# EasyEDA schematic 1-Schematic_main_project_bg-butwal.json
TITLE: Sheet_1; REV: 1.0; Date: 2026-04-19; Sheet: 1/1; Drawn By: niranjanstha11; Company: Your Company
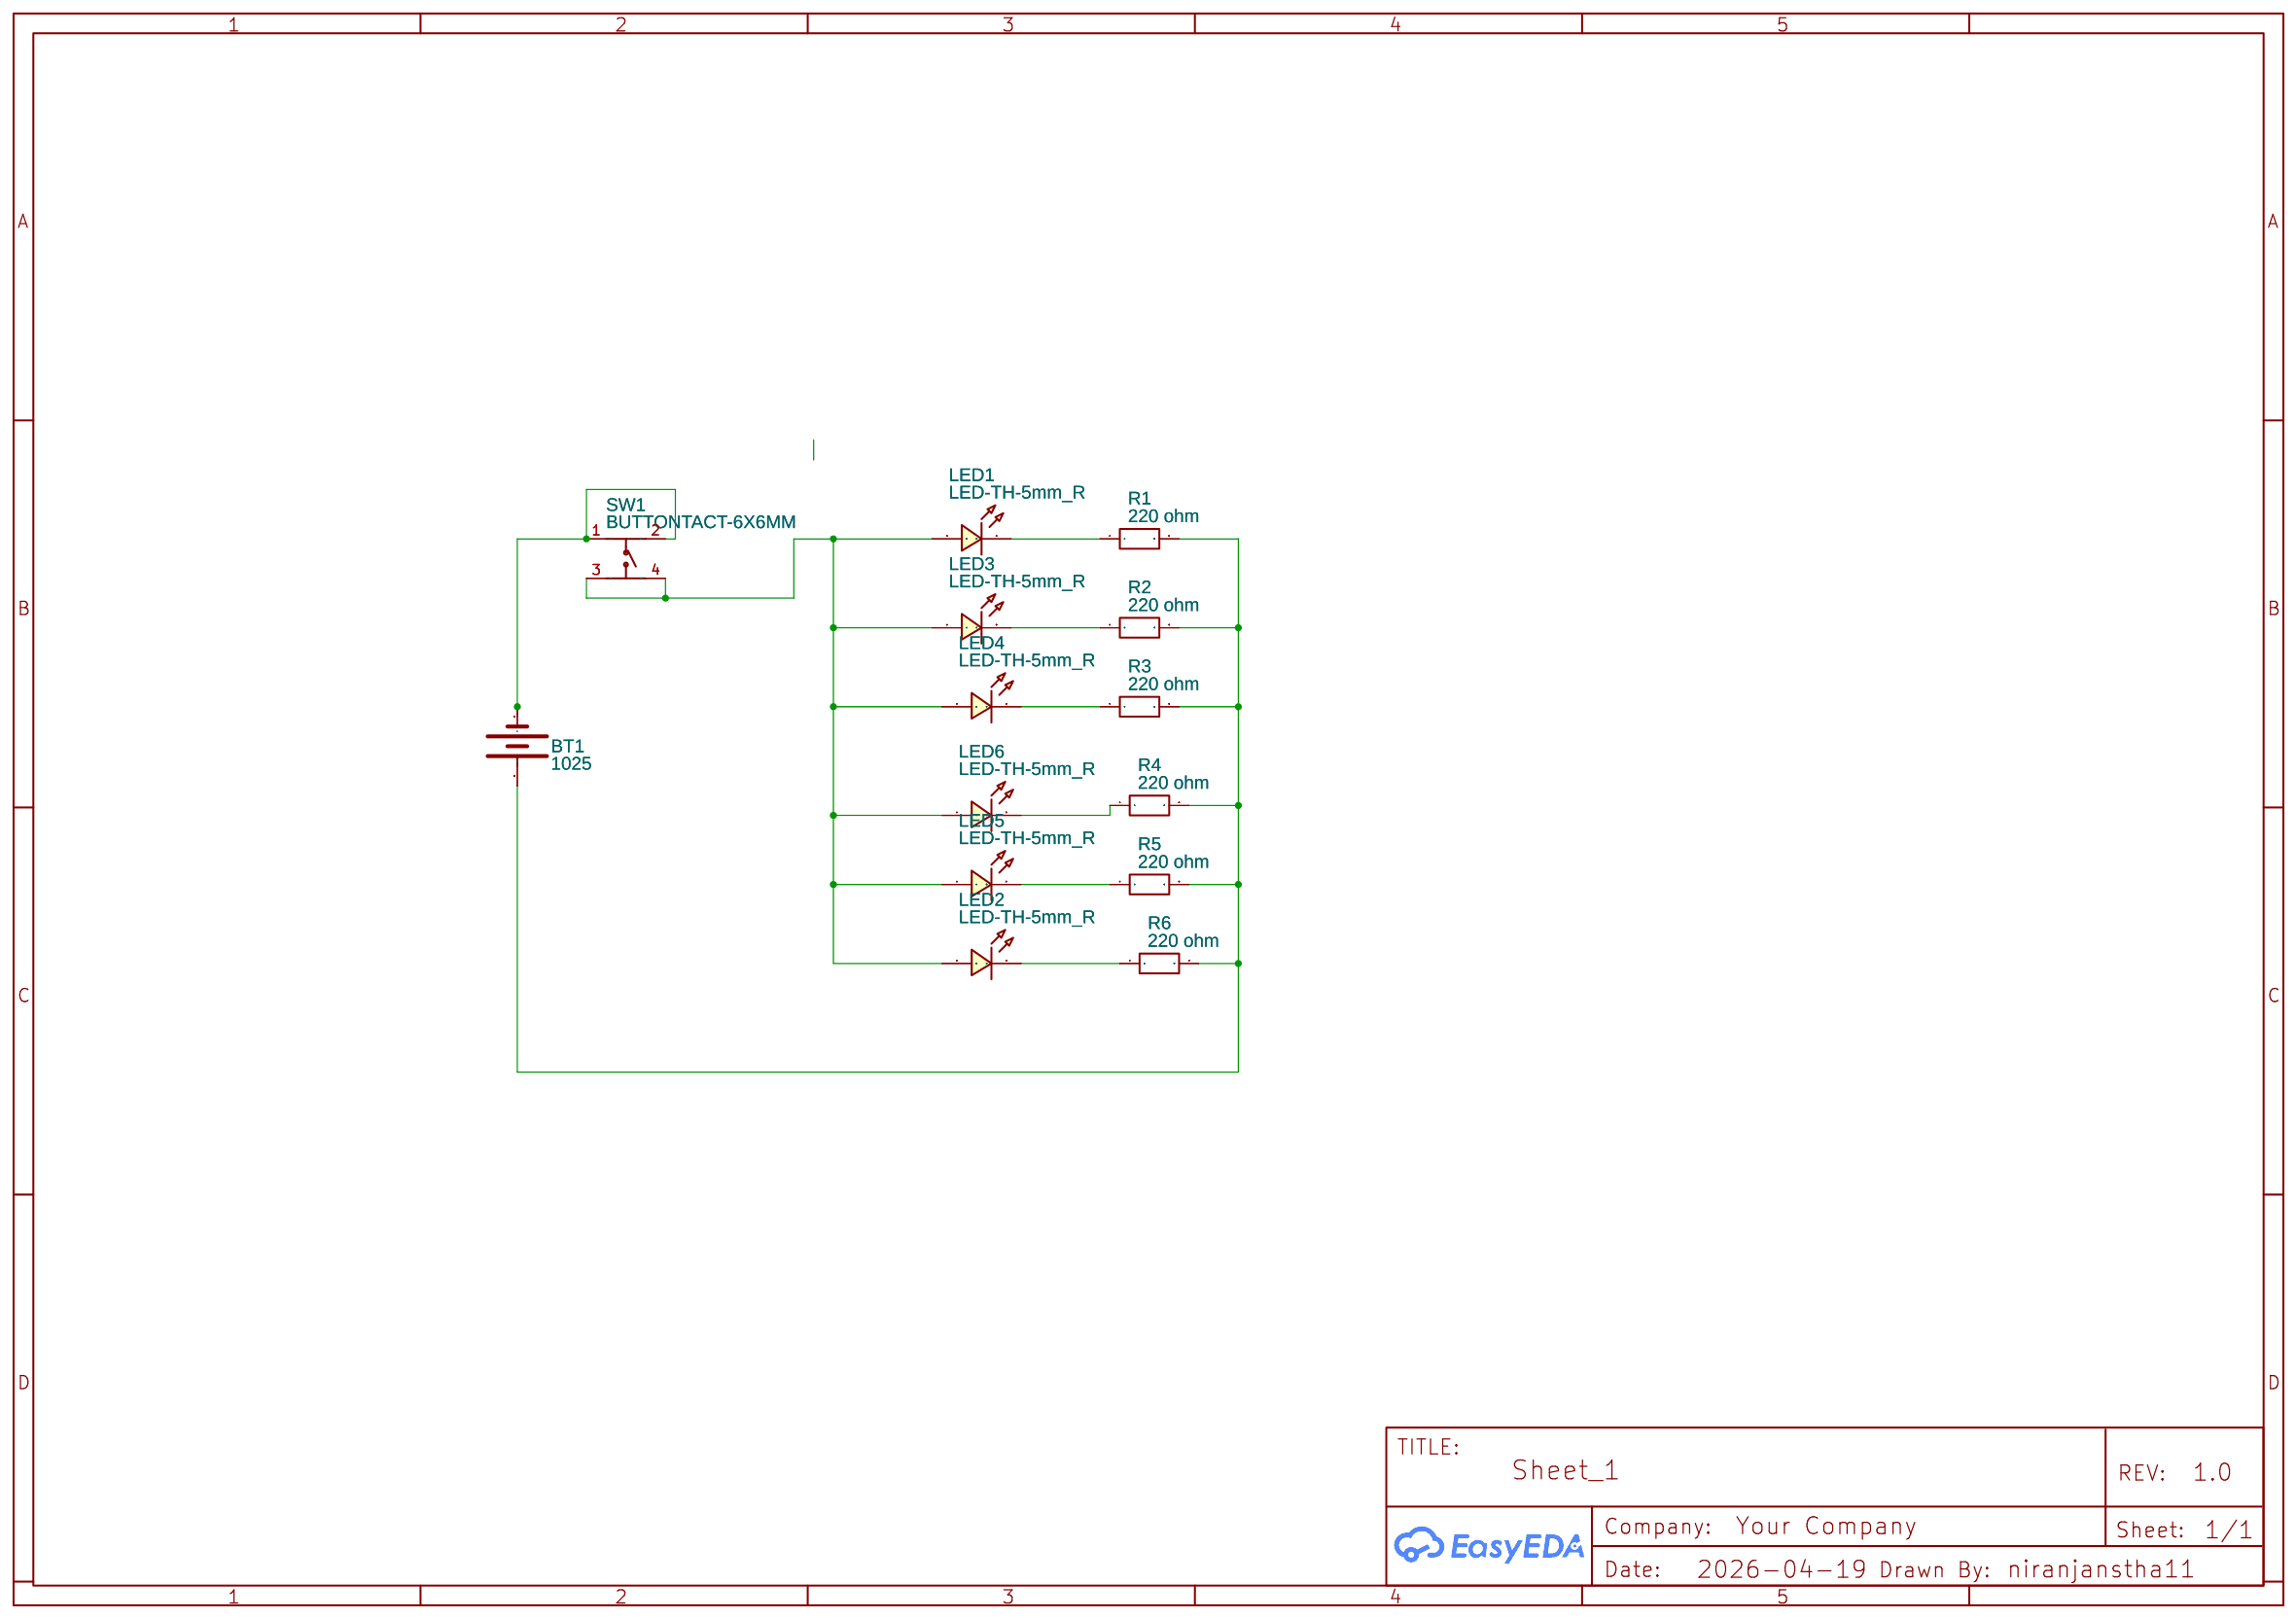
[diagram p0: schematic sheet]

## Parts
BT1  1025  [BAT-TH_KEYSTONE-1025]
LED1  LED-TH-5mm_R  [LED-TH_BD5.0_RED]
LED2  LED-TH-5mm_R  [LED-TH_BD5.0_RED]
LED3  LED-TH-5mm_R  [LED-TH_BD5.0_RED]
LED4  LED-TH-5mm_R  [LED-TH_BD5.0_RED]
LED5  LED-TH-5mm_R  [LED-TH_BD5.0_RED]
LED6  LED-TH-5mm_R  [LED-TH_BD5.0_RED]
R1  220 ohm  [R0603]
R2  220 ohm  [R0603]
R3  220 ohm  [R0603]
R4  220 ohm  [R0603]
R5  220 ohm  [R0603]
R6  220 ohm  [R0603]
SW1  BUTTONTACT-6X6MM  [SW-SMD_4P-L6.0-W6.0-P4.50-LS9.2]

## Library data of the parts
BT1 = 1025: Contributor: LCSC; Supplier: LCSC; Supplier Part: C238060; Manufacturer: Keystone; JLCPCB Part Class: Extended Part
LED1-LED6 = LED-TH-5mm_R: Manufacturer: EVERLIGHT(台湾亿光); Manufacturer Part: 333-2SURD/S530-A3; Supplier Part: C87271; Supplier: LCSC; Contributor: LCEDA_Lib
R1-R6 = R_0603_EU: Contributor: LCEDA_Lib
SW1 = BUTTONTACT-6X6MM: Supplier: LCSC; Supplier Part: C9900004221; Manufacturer Part: Buttontact-6x6mm; JLCPCB Part Class: Extended Part; Contributor: rosuanamaria

## Nets
Net-(BT1-1): BT1.1(+) R1.2 R2.2 R3.2 R4.2 R5.2 R6.2
Net-(BT1-2): BT1.2(-) SW1.1(A) SW1.2(B)
Net-(LED1-1): LED1.1 LED2.1 LED3.1 LED4.1 LED5.1 LED6.1 SW1.3(C) SW1.4(D)
Net-(LED1-2): LED1.2 R1.1
Net-(LED2-2): LED2.2 R6.1
Net-(LED3-2): LED3.2 R2.1
Net-(LED4-2): LED4.2 R3.1
Net-(LED5-2): LED5.2 R5.1
Net-(LED6-2): LED6.2 R4.1
